# Altium schematic sheet 301_GridPos3.SchDoc: Grid Position 3 / USB 2
size A2; Organization: Greenfield Tech Solutions; Address1: Molendreef 33; Address2: Ossendrecht; Address3: 4641CS; Address4: The Netherlands; SheetNumber: 4; SheetTotal: 9
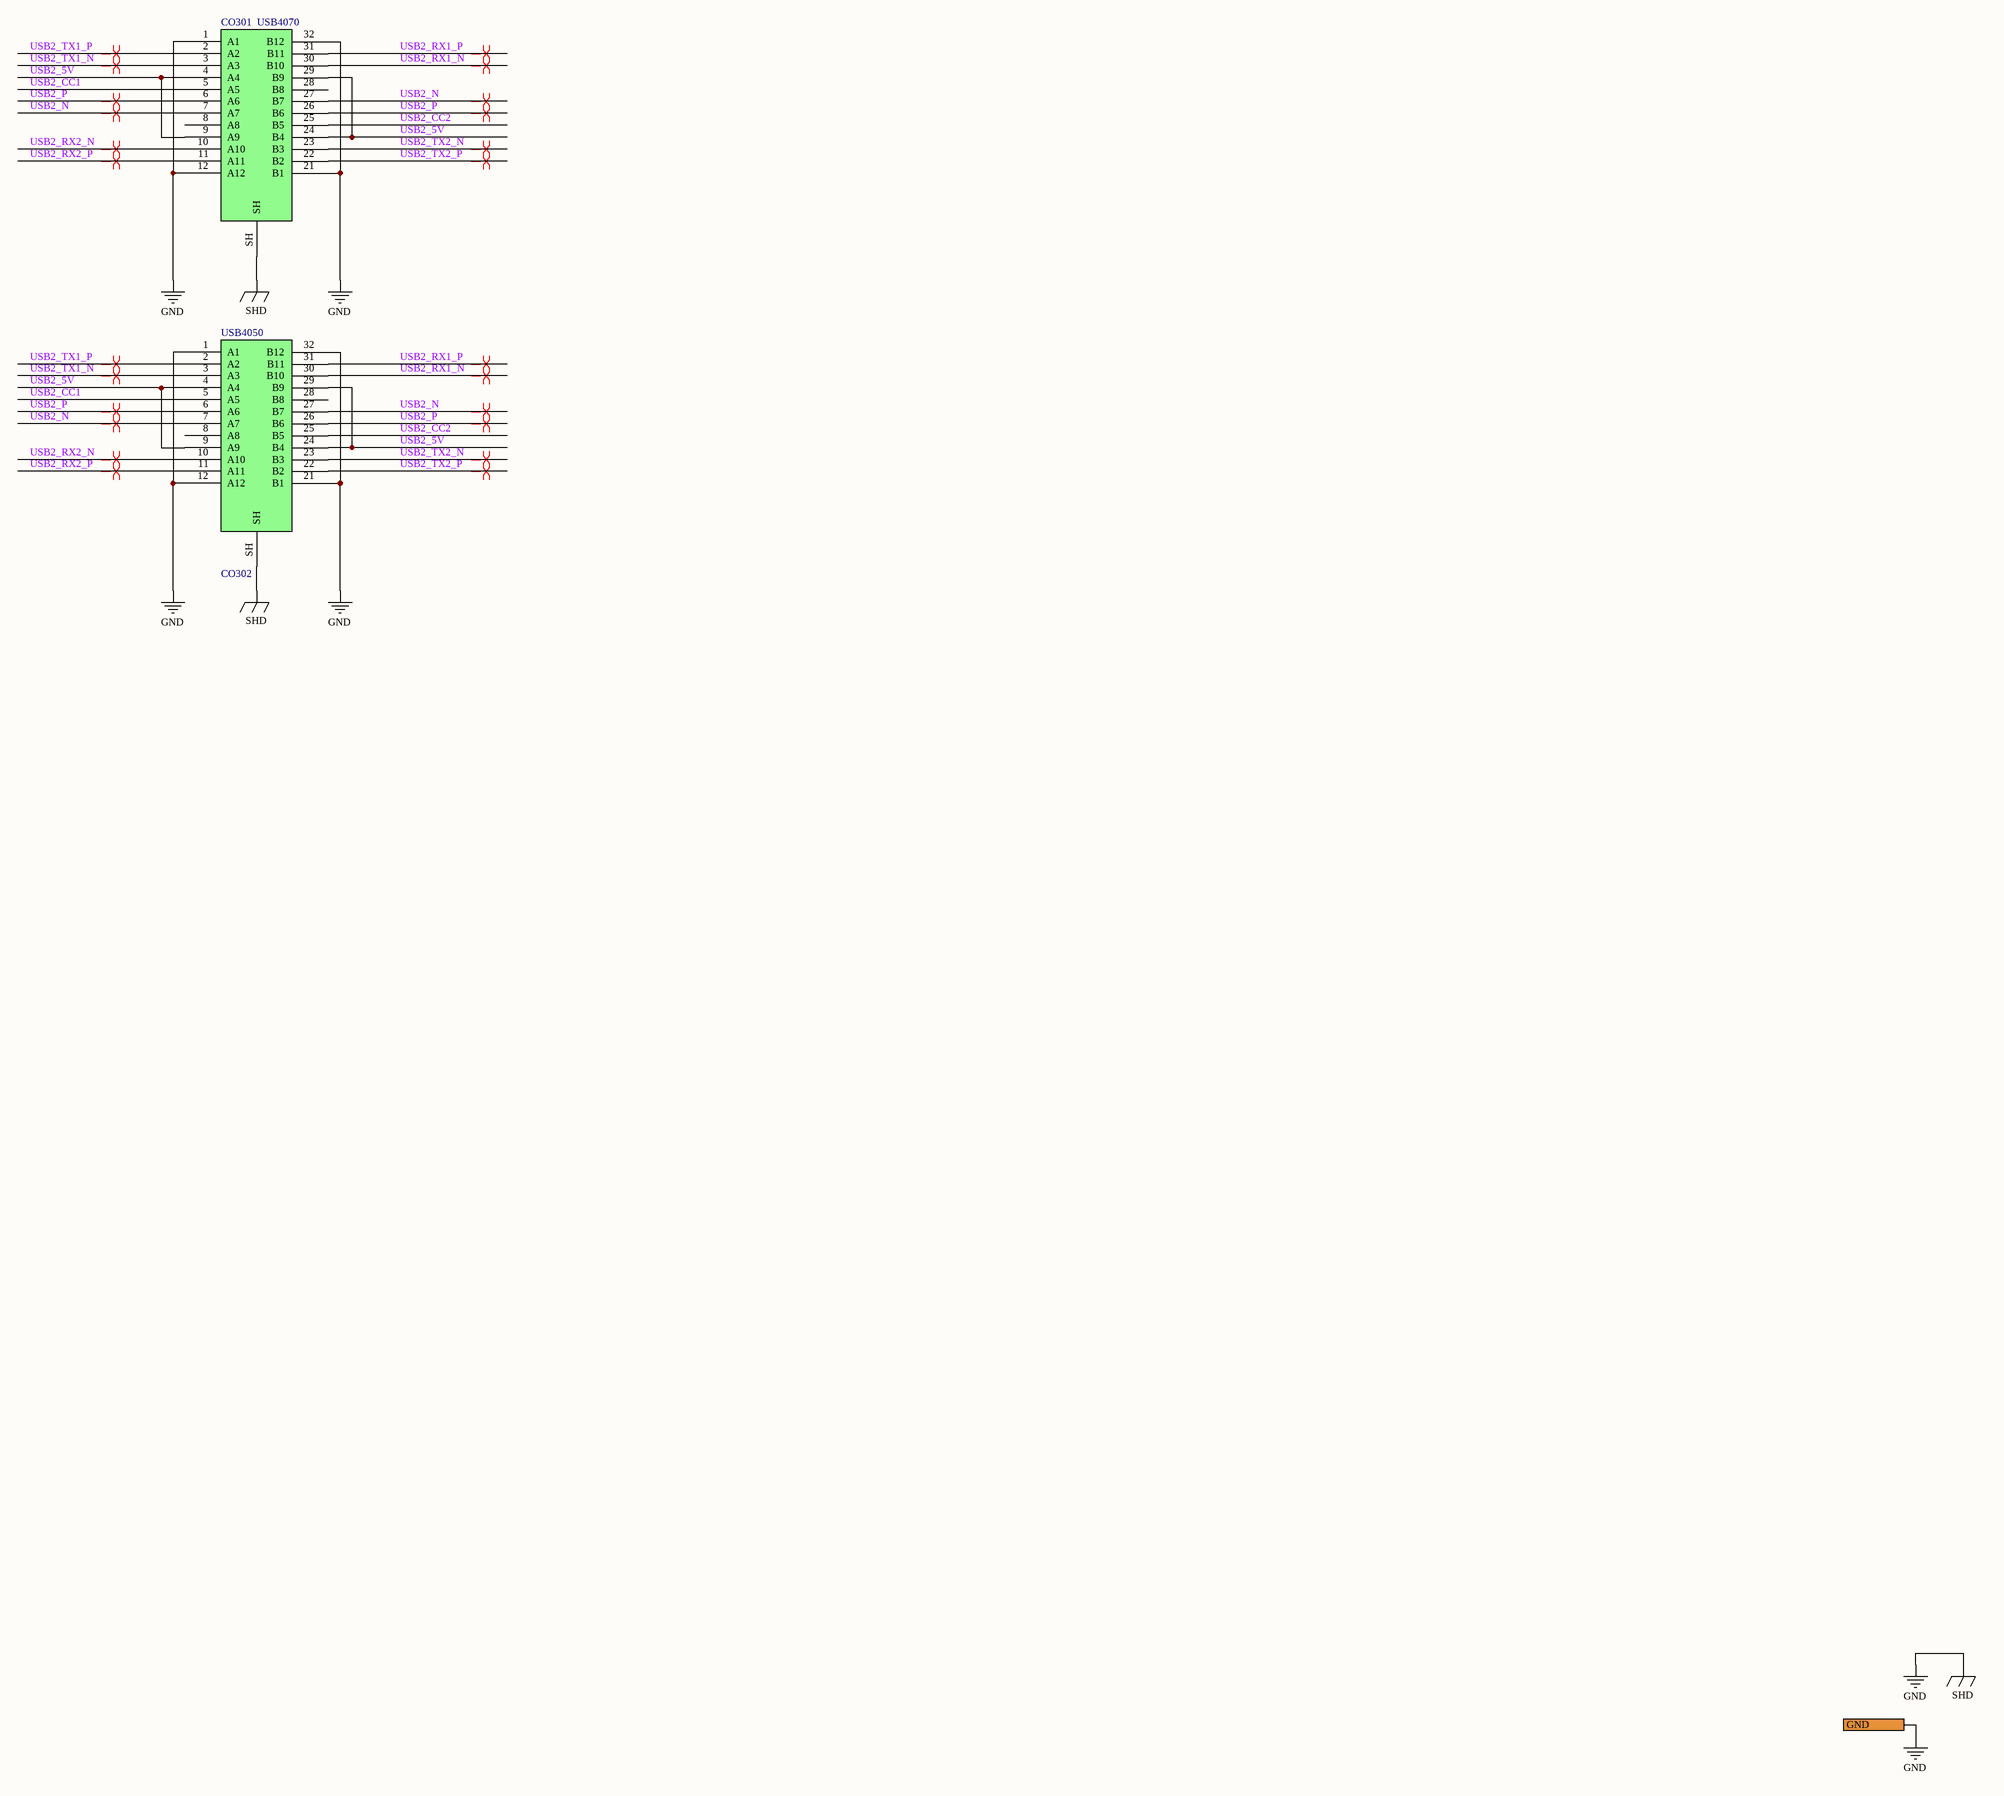
[diagram p0: 301_GridPos3.SchDoc]

## Parts
CO301  USB4070  [USB4070-30-C]
CO302  USB4050  [USB4050-30-A]

## Ports
GND

## Nets
GND: CO301.1(A1) CO301.12(A12) CO301.21(B1) CO301.32(B12) CO301.SH CO302.1(A1) CO302.12(A12) CO302.21(B1) CO302.32(B12) CO302.SH ; port GND  [also labelled SHD]
USB2_5V: CO301.4(A4) CO301.9(A9) CO301.24(B4) CO301.29(B9) CO302.4(A4) CO302.9(A9) CO302.24(B4) CO302.29(B9)
USB2_CC1: CO301.5(A5) CO302.5(A5)
USB2_CC2: CO301.25(B5) CO302.25(B5)
USB2_N: CO301.7(A7) CO301.27(B7) CO302.7(A7) CO302.27(B7)
USB2_P: CO301.6(A6) CO301.26(B6) CO302.6(A6) CO302.26(B6)
USB2_RX1_N: CO301.30(B10) CO302.30(B10)
USB2_RX1_P: CO301.31(B11) CO302.31(B11)
USB2_RX2_N: CO301.10(A10) CO302.10(A10)
USB2_RX2_P: CO301.11(A11) CO302.11(A11)
USB2_TX1_N: CO301.3(A3) CO302.3(A3)
USB2_TX1_P: CO301.2(A2) CO302.2(A2)
USB2_TX2_N: CO301.23(B3) CO302.23(B3)
USB2_TX2_P: CO301.22(B2) CO302.22(B2)

Not connected (* = marked no-connect by the designer): CO301 8(A8) 28(B8); CO302 8(A8) 28(B8)

## Layout directives
differential pair; differential pair class USB3: USB2_N, USB2_P, USB2_RX1_N, USB2_RX1_P, USB2_RX2_N, USB2_RX2_P, USB2_TX1_N, USB2_TX1_P, USB2_TX2_N, USB2_TX2_P

## Notes on the sheet
- Title
- Size:
- Date:
- File:
- A2
- Number:
- Time:
- Revision:
- Sheet
- of

## Library data of the parts
CO301 = CO0021: USB4070-30-C; Part Number: CO0021; ID: 16; RefVal: USB4070; ManfactPart: USB4070-30-C
CO302 = CO0039: USB C connector Receptacle Horizontal; Part Number: CO0039; ID: 39; RefVal: USB4050; ManfactPart: USB4050-30-A